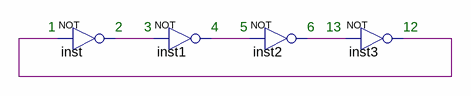
[diagram p0: schematic sheet]
// Quartus schematic Ring_Oscillator.bdf as structural Verilog: 4 symbols, 0 pins
module Ring_Oscillator (
);

  wire inst1_out, inst2_out, inst3_out, inst_out;

  not inst (inst_out, inst3_out);
  not inst1 (inst1_out, inst_out);
  not inst2 (inst2_out, inst1_out);
  not inst3 (inst3_out, inst2_out);

  // Notes on the sheet:
  //   1
  //   2
  //   3
  //   4
  //   5
  //   6
  //   13
  //   12
endmodule
